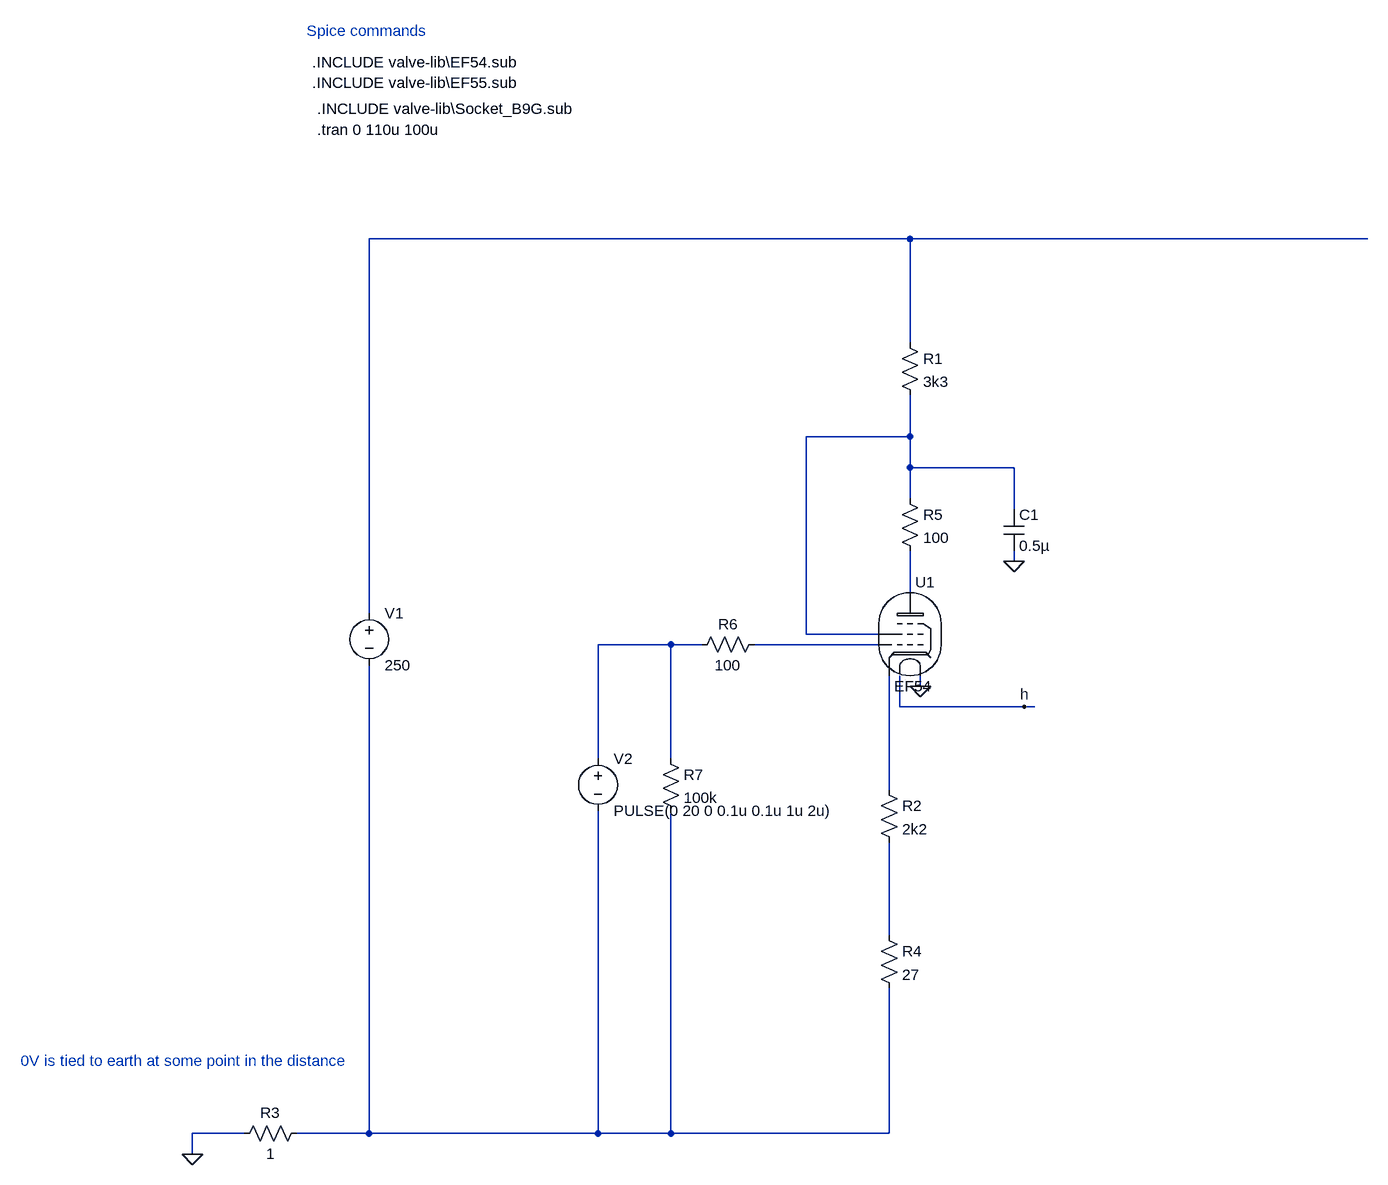
[diagram p0: schematic clock_buffer_test.asc]
clock_buffer_test.asc, the LTspice schematic file:
Version 4
SHEET 1 1236 964
WIRE 208 -464 -624 -464
WIRE 912 -464 208 -464
WIRE 208 -304 208 -464
WIRE 208 -160 208 -224
WIRE 208 -160 48 -160
WIRE 208 -112 208 -160
WIRE 368 -112 208 -112
WIRE 208 -64 208 -112
WIRE 368 -48 368 -112
WIRE 368 32 368 16
WIRE 208 80 208 16
WIRE -624 112 -624 -464
WIRE 48 144 48 -160
WIRE 160 144 48 144
WIRE -160 160 -272 160
WIRE -112 160 -160 160
WIRE 160 160 -32 160
WIRE 224 224 224 208
WIRE 192 256 192 208
WIRE 384 256 192 256
WIRE 400 256 384 256
WIRE -272 336 -272 160
WIRE -160 336 -160 160
WIRE 176 384 176 208
WIRE 176 608 176 464
WIRE -816 912 -896 912
WIRE -624 912 -624 192
WIRE -624 912 -736 912
WIRE -272 912 -272 416
WIRE -272 912 -624 912
WIRE -160 912 -160 416
WIRE -160 912 -272 912
WIRE 176 912 176 688
WIRE 176 912 -160 912
WIRE -896 944 -896 912
FLAG 368 32 0
FLAG -896 944 0
FLAG 384 256 h
FLAG 224 224 0
SYMBOL EF54 208 144 R0
SYMATTR InstName U1
SYMBOL voltage -624 96 R0
WINDOW 123 0 0 Left 2
WINDOW 39 0 0 Left 2
SYMATTR InstName V1
SYMATTR Value 250
SYMBOL res 192 -320 R0
SYMATTR InstName R1
SYMATTR Value 3k3
SYMBOL res 160 368 R0
SYMATTR InstName R2
SYMATTR Value 2k2
SYMBOL cap 352 -48 R0
SYMATTR InstName C1
SYMATTR Value 0.5µ
SYMBOL res -720 896 R90
WINDOW 0 0 56 VBottom 2
WINDOW 3 32 56 VTop 2
SYMATTR InstName R3
SYMATTR Value 1
SYMBOL voltage -272 320 R0
WINDOW 123 0 0 Left 2
WINDOW 39 0 0 Left 2
SYMATTR InstName V2
SYMATTR Value PULSE(0 20 0 0.1u 0.1u 1u 2u)
SYMBOL res 160 592 R0
SYMATTR InstName R4
SYMATTR Value 27
SYMBOL res 192 -80 R0
SYMATTR InstName R5
SYMATTR Value 100
SYMBOL res -16 144 R90
WINDOW 0 0 56 VBottom 2
WINDOW 3 32 56 VTop 2
SYMATTR InstName R6
SYMATTR Value 100
SYMBOL res -176 320 R0
SYMATTR InstName R7
SYMATTR Value 100k
TEXT -712 -736 Left 2 !.INCLUDE valve-lib\\EF54.sub
TEXT -704 -632 Left 2 !.tran 0 110u 100u
TEXT -720 -784 Left 2 ;Spice commands
TEXT -1160 800 Left 2 ;0V is tied to earth at some point in the distance
TEXT -712 -704 Left 2 !.INCLUDE valve-lib\\EF55.sub
TEXT -704 -664 Left 2 !.INCLUDE valve-lib\\Socket_B9G.sub

The netlist it stands for:
* clock_buffer_test.asc
XU1 N005 N002 N003 N006 0 h EF54  ; pins G1 G2 Anode Cathode Heater_R Heater_L
V1 N001 N008 250
R1 N001 N002 3k3
R2 N006 N007 2k2
C1 N002 0 0.5µ
R3 N008 0 1
V2 N004 N008 PULSE(0 20 0 0.1u 0.1u 1u 2u)
R4 N007 N008 27
R5 N002 N003 100
R6 N005 N004 100
R7 N004 N008 100k
.INCLUDE valve-lib\EF54.sub
.tran 0 110u 100u
* Spice commands
* 0V is tied to earth at some point in the distance
.INCLUDE valve-lib\EF55.sub
.INCLUDE valve-lib\Socket_B9G.sub
.backanno
.end